# EAGLE design KeyboardPower (EAGLE 7.7.0)
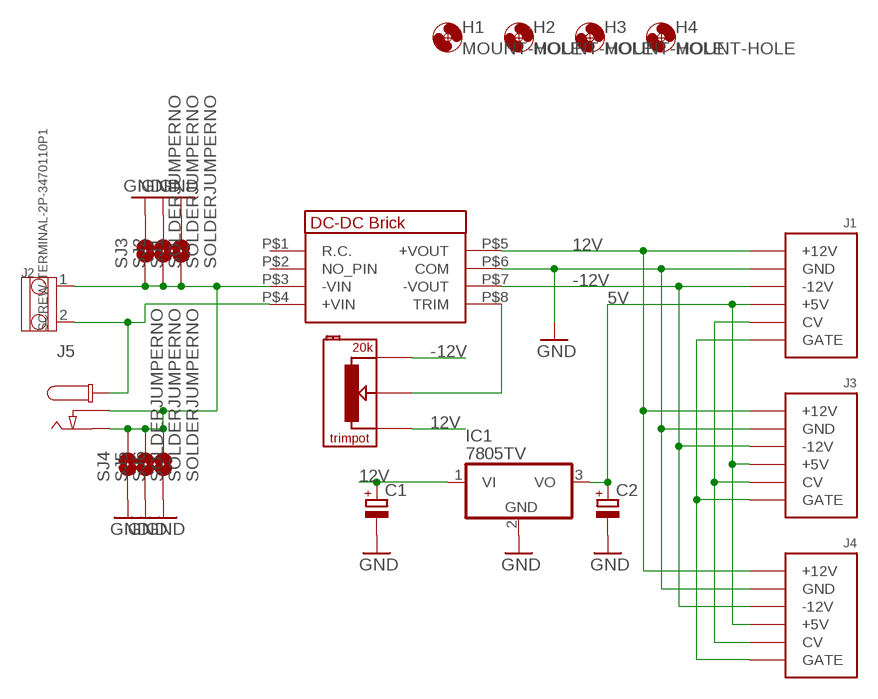
[diagram p0: schematic, sheet 1]

## Parts
C1  CAPACITOR_POL-CASE_B  [CASE_B]
C2  CAPACITOR_POL-CASE_B  [CASE_B]
H1  MOUNT-HOLE  [3.2-NOMARKINGS-SMALLSAFEZONE]
H2  MOUNT-HOLE  [3.2-NOMARKINGS-SMALLSAFEZONE]
H3  MOUNT-HOLE  [3.2-NOMARKINGS-SMALLSAFEZONE]
H4  MOUNT-HOLE  [3.2-NOMARKINGS-SMALLSAFEZONE]
IC1  7805TV  [TO220V]
J1  POWERSHROUDED  [POWER_16_SHROUDED]
J2  SCREW-TERMINAL-2P-3470110P1  [2P-5.0]
J3  POWER_SHROUDED_NOTEXT  [POWER_16_SHROUDED_NOTEXT]
J4  POWER_SHROUDED_NOTEXT  [POWER_16_SHROUDED_NOTEXT]
J5  CON_DC_M-DC_PTH2  [DC_BARREL_JACK_PTH_2MM_2]
R1  20k  TRIMPOT  [TRIMPOT]
SJ1  SOLDERJUMPERNO  [SJ_2S-NO]
SJ2  SOLDERJUMPERNO  [SJ_2S-NO]
SJ3  SOLDERJUMPERNO  [SJ_2S-NO]
SJ4  SOLDERJUMPERNO  [SJ_2S-NO]
SJ5  SOLDERJUMPERNO  [SJ_2S-NO]
SJ6  SOLDERJUMPERNO  [SJ_2S-NO]
U$1  DKA30  [MEANWELL_DKA30]

## Nets
5V: C2.+ IC1.3(VO) J1.11(+5V) J1.12(+5V) J3.11(+5V) J3.12(+5V) J4.11(+5V) J4.12(+5V)
12V: C1.+ IC1.1(VI) J1.9(+12V) J1.10(+12V) J3.9(+12V) J3.10(+12V) J4.9(+12V) J4.10(+12V) R1.P$1 U$1.P$5(+VOUT)
-12V: J1.1(-12V) J1.2(-12V) J3.1(-12V) J3.2(-12V) J4.1(-12V) J4.2(-12V) R1.P$3 U$1.P$7(-VOUT)
GND: C1.- C2.- IC1.2(GND) J1.3(GND) J1.4(GND) J1.5(GND) J1.6(GND) J1.7(GND) J1.8(GND) J3.3(GND) J3.4(GND) J3.5(GND) J3.6(GND) J3.7(GND) J3.8(GND) J4.3(GND) J4.4(GND) J4.5(GND) J4.6(GND) J4.7(GND) J4.8(GND) SJ1.2 SJ2.2 SJ3.2 SJ4.1 SJ5.1 SJ6.1 U$1.P$6(COM)
N$1: J2.1 J5.P2(P3) J5.P3(P2) SJ1.1 SJ2.1 SJ3.1 SJ4.2 SJ5.2 SJ6.2 U$1.P$3(-VIN)
N$2: J1.15(GATE) J1.16(GATE) J3.15(GATE) J3.16(GATE) J4.15(GATE) J4.16(GATE)
N$3: J1.13(CV) J1.14(CV) J3.13(CV) J3.14(CV) J4.13(CV) J4.14(CV)
N$4: R1.P$2 U$1.P$8(TRIM)
POSITIVE_INPUT: J2.2 J5.P1 U$1.P$4(+VIN)
Unconnected: U$1.P$1(R.C.) U$1.P$2(NO_PIN)

## Library data of the parts
C1 C2 = dp_devices:CAPACITOR_POL: Polarized capacitor in various packages
H1-H4 = zephod-components:MOUNT-HOLE: MOUNTING HOLE with drill center marker
IC1 = linear:78*: Positive VOLTAGE REGULATOR Source: http://cache.national.com/ds/LM/LM78L05.pdf http://www.fairchildsemi.com/ds/LM/LM7805.pdf
J1 J3 J4 = EurorackModularParts:POWER
J2 = OPL:SCREW-TERMINAL-2P
J5 = dp_devices:CON_DC_M: DC power connector
R1 = EurorackModularParts:TRIMPOT
SJ1-SJ6 = SparkFun-Passives:SOLDERJUMPER: Solder Jumper Standard SMD solder jumper. Used to automate production. Two varients : Normally Open and Normally Closed are the same, but have different paste layers. NC will have a large amount of paste and should jumper during reflow.
U$1 = EurorackModularParts:DKA30

## Net classes
0 default: width 0.5 mm

## Board
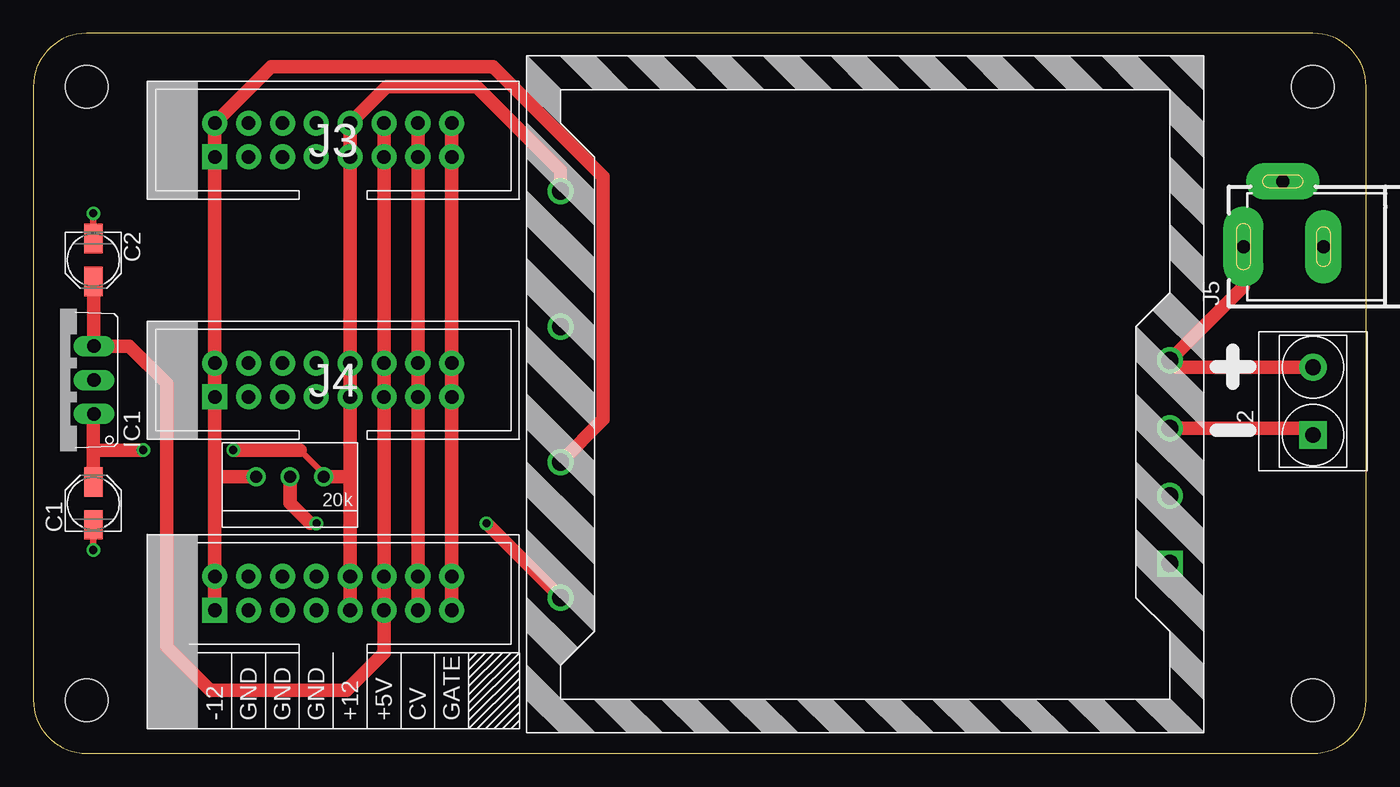
[diagram p1: board, top side]
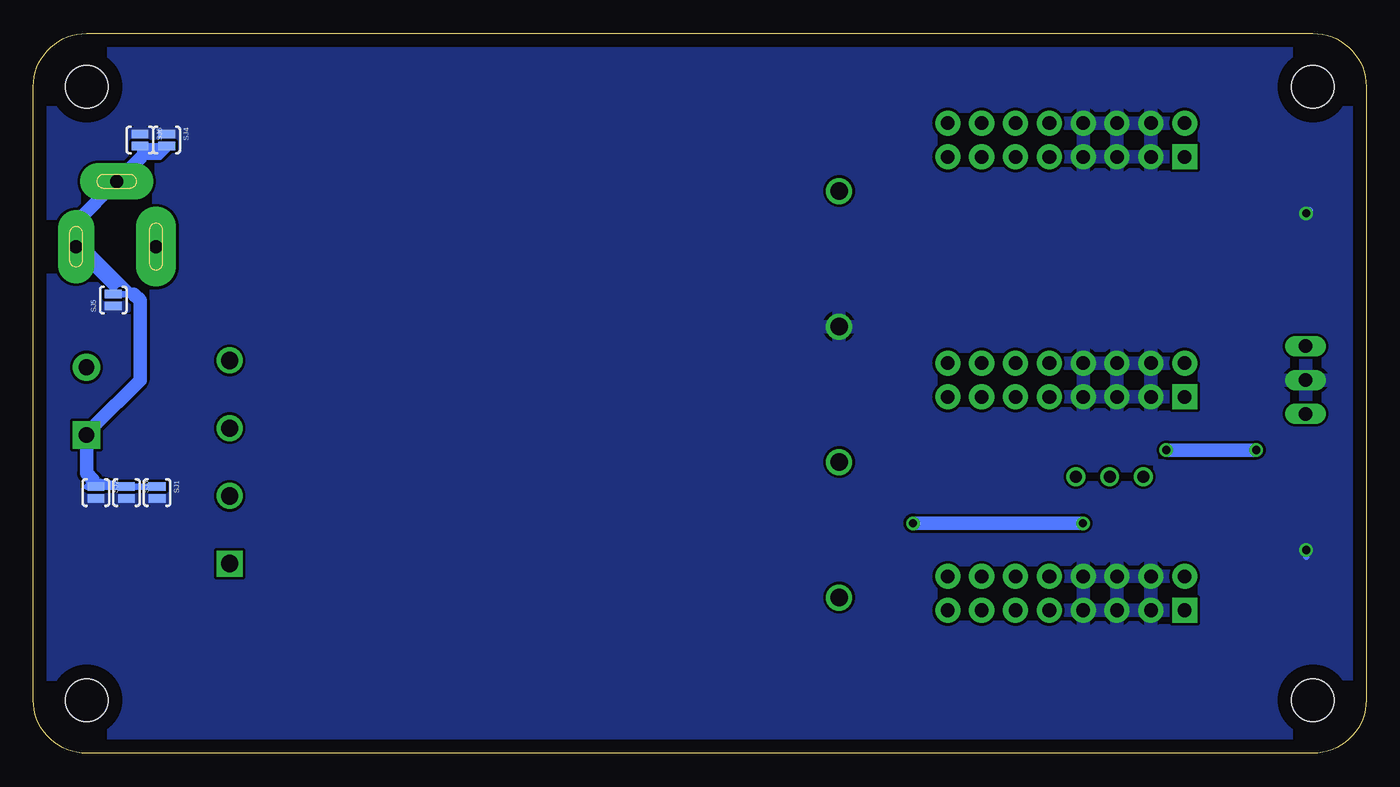
[diagram p2: board, bottom side, seen from below]

Size 100 x 54 mm. Coordinates in mm from the lower left corner, seen from the top.
Outline: 0,50 0,4 arc90 4,0 96,0 arc90 100,4 100,50 arc90 96,54 4,54 arc90 0,50
Copper layers (1*16): Top 0.035mm / dielectric 1.5mm / Bottom 0.035mm
Design rules "default": minimum track width 10mil, minimum drill 24mil, track to track 8mil, track to pad 8mil, pad to pad 8mil, via to via 8mil, smd to smd 8mil, copper to edge 40mil, drill to drill 8mil, minimum pad ring 10mil, minimum via ring 8mil, stop-mask expansion 4mil, vias tented up to drill 0mil, thermal gap 10mil

### Footprints (pad centres in the part's own frame; a part is rotated, then mirrored left to right if it is on the bottom)
CASE_B = smd 2.2 x 1.4: + 1.6,0; - -1.6,0
3.2-NOMARKINGS-SMALLSAFEZONE = hole 3.2: 0,0
TO220V = drill 1.016 long: 1 -2.54,-2.54; 2 0,-2.54; 3 2.54,-2.54
POWER_16_SHROUDED = drill 1.016 pad 1.88 square: 1 -8.89,-1.27 | drill 1.016 pad 1.88: 2 -8.89,1.27; 3 -6.35,-1.27; 4 -6.35,1.27; 5 -3.81,-1.27; 6 -3.81,1.27; 7 -1.27,-1.27; 8 -1.27,1.27; 9 1.27,-1.27; 10 1.27,1.27; 11 3.81,-1.27; 12 3.81,1.27; 13 6.35,-1.27; 14 6.35,1.27; 15 8.89,-1.27; 16 8.89,1.27
2P-5.0 = drill 1.168 pad 2.032 square: 1 -2.54,0 | drill 1.168 pad 2.032: 2 2.54,0
POWER_16_SHROUDED_NOTEXT = drill 1.016 pad 1.88 square: 1 -8.89,-1.27 | drill 1.016 pad 1.88: 2 -8.89,1.27; 3 -6.35,-1.27; 4 -6.35,1.27; 5 -3.81,-1.27; 6 -3.81,1.27; 7 -1.27,-1.27; 8 -1.27,1.27; 9 1.27,-1.27; 10 1.27,1.27; 11 3.81,-1.27; 12 3.81,1.27; 13 6.35,-1.27; 14 6.35,1.27; 15 8.89,-1.27; 16 8.89,1.27
DC_BARREL_JACK_PTH_2MM_2 = drill 1 pad 3 long: P1 0,5.205 | drill 1 pad 2.75 long: P2 4.9,2.255; P3 0,-0.795
TRIMPOT = drill 0.9: P$1 -2.54,0; P$2 0,0; P$3 2.54,0
SJ_2S-NO = smd 0.635 x 1.27: 1 -0.45,0; 2 0.45,0
MEANWELL_DKA30 = drill 1.3 square: P$1 0,0 | drill 1.3: P$2 5.08,0; P$3 10.16,0; P$4 15.24,0; P$5 27.94,45.72; P$6 17.78,45.72; P$7 7.62,45.72; P$8 -2.54,45.72

### Placement (x,y rotation side)
C1  4.5,18.75 90 top
C2  4.5,37 270 top
H1  4,4 0 top
H2  96,4 0 top
H3  96,50 0 top
H4  4,50 0 top
IC1  2,28 90 top
J1  22.5,12 0 top
J2  96.01,26.42 90 top
J3  22.5,46 0 top
J4  22.5,28 0 top
J5  96,38 90 top
R1  19.25,20.75 180 top
SJ1  90.71,19.55 270 bottom
SJ2  95.3,19.55 270 bottom
SJ3  93.01,19.55 270 bottom
SJ4  90,46 270 bottom
SJ5  94,34 90 bottom
SJ6  92,46 270 bottom
U$1  85.27,14.23 90 top

### Tracks (layer width: path | path; a pad name or v marks a point on that pad's centre or on a via)
5V
  Top 0.5: 4.54,35.36 C2.+
  Top 1: J3.12 J3.11 J4.12 J4.11 J1.12 J1.11 26.31,7.56 23.5,4.75 13.25,4.75 10,8 10,27.75 7.21,30.54 IC1.3 4.54,35.36
12V  (via drill 0.61)
  Top 0.5: 4.5,25.42 IC1.1 | R1.P$1 21.79,20.96 20,22.75
  Top 1: 23.77,20.75 J4.9 J4.10 J3.9 J3.10 26.5,50 33.25,50 39.55,43.7 U$1.P$5 | 23.77,20.75 J1.10 J1.9 | R1.P$1 23.77,20.75 | C1.+ 4.5,22.75 | 4.5,22.75 4.5,25.42 | 20,22.75 v15,22.75 | v8.25,22.75 4.5,22.75
  Bottom 1: v15,22.75 v8.25,22.75
-12V
  Top 0.5: 13.86,20.75 13.61,21
  Top 1: J1.1 J1.2 13.61,21 J4.1 J4.2 J3.1 J3.2 17.84,51.5 34.5,51.5 42.75,43.25 42.75,25.05 U$1.P$7 | R1.P$3 13.86,20.75
GND  (via drill 0.61)
  Top 0.5: C1.- v4.5,15.25 | C2.- v4.5,40.5
  Bottom 0.5: v4.5,15.25 4.5,14.75 | v4.5,40.5 4.5,40.75 4.25,40.75
  pour Bottom: -3.5,56.75 101.25,56.75 arc-90 105.25,52.75 105.25,-2.75 0.25,-2.75 arc-90 -3.75,1.25 -3.75,56.5 arc-90
N$1
  Top 0.5: 95.5,24.39 J2.1
  Top 1: U$1.P$3 94.28,24.39 95.5,24.39
  Bottom 0.5: SJ4.2 SJ6.2 92,44.75 | 92,44.75 92,44.65 | 96,20 SJ2.1 SJ3.1 95.5,20.5 96,20 | 96,20 92.72,20 SJ1.1 | 92.45,34.45 SJ5.2 94,35.2 93.2,35.2 | 93.2,35.2 92,34 | 93.2,35.2 96,38 | 92,44.75 90.5,44.75 89.75,45.5 90.25,45.5 90.75,45 91,45.25 91.5,45.25 91.75,45 | 95.5,24.5 95.5,24.39 J2.1
  Bottom 1: 92,44.65 J5.P2 96.8,39.85 J5.P3 94,35.2 | J2.1 96.01,21 95.5,20.5 | 95.5,24.5 92,28 92,34 92.45,34.45
N$2
  Top 1: J1.15 J1.16 J4.15 J4.16 J3.15 J3.16
N$3
  Top 1: J3.14 J3.13 J4.14 J4.13 J1.14 J1.13
N$4  (via drill 0.61)
  Top 0.5: U$1.P$8 | v21.25,17.25 20.75,17.25
  Top 1: U$1.P$8 v34,17.25 | 20.75,17.25 19.25,18.75 R1.P$2
  Bottom 1: v34,17.25 v21.25,17.25
POSITIVE_INPUT
  Top 1: J5.P1 90.8,34.99 U$1.P$4 85.78,28.96 J2.2